# Altium schematic sheet Schemat_ideowy.SchDoc
size A4; SheetNumber: 1; SheetTotal: 1
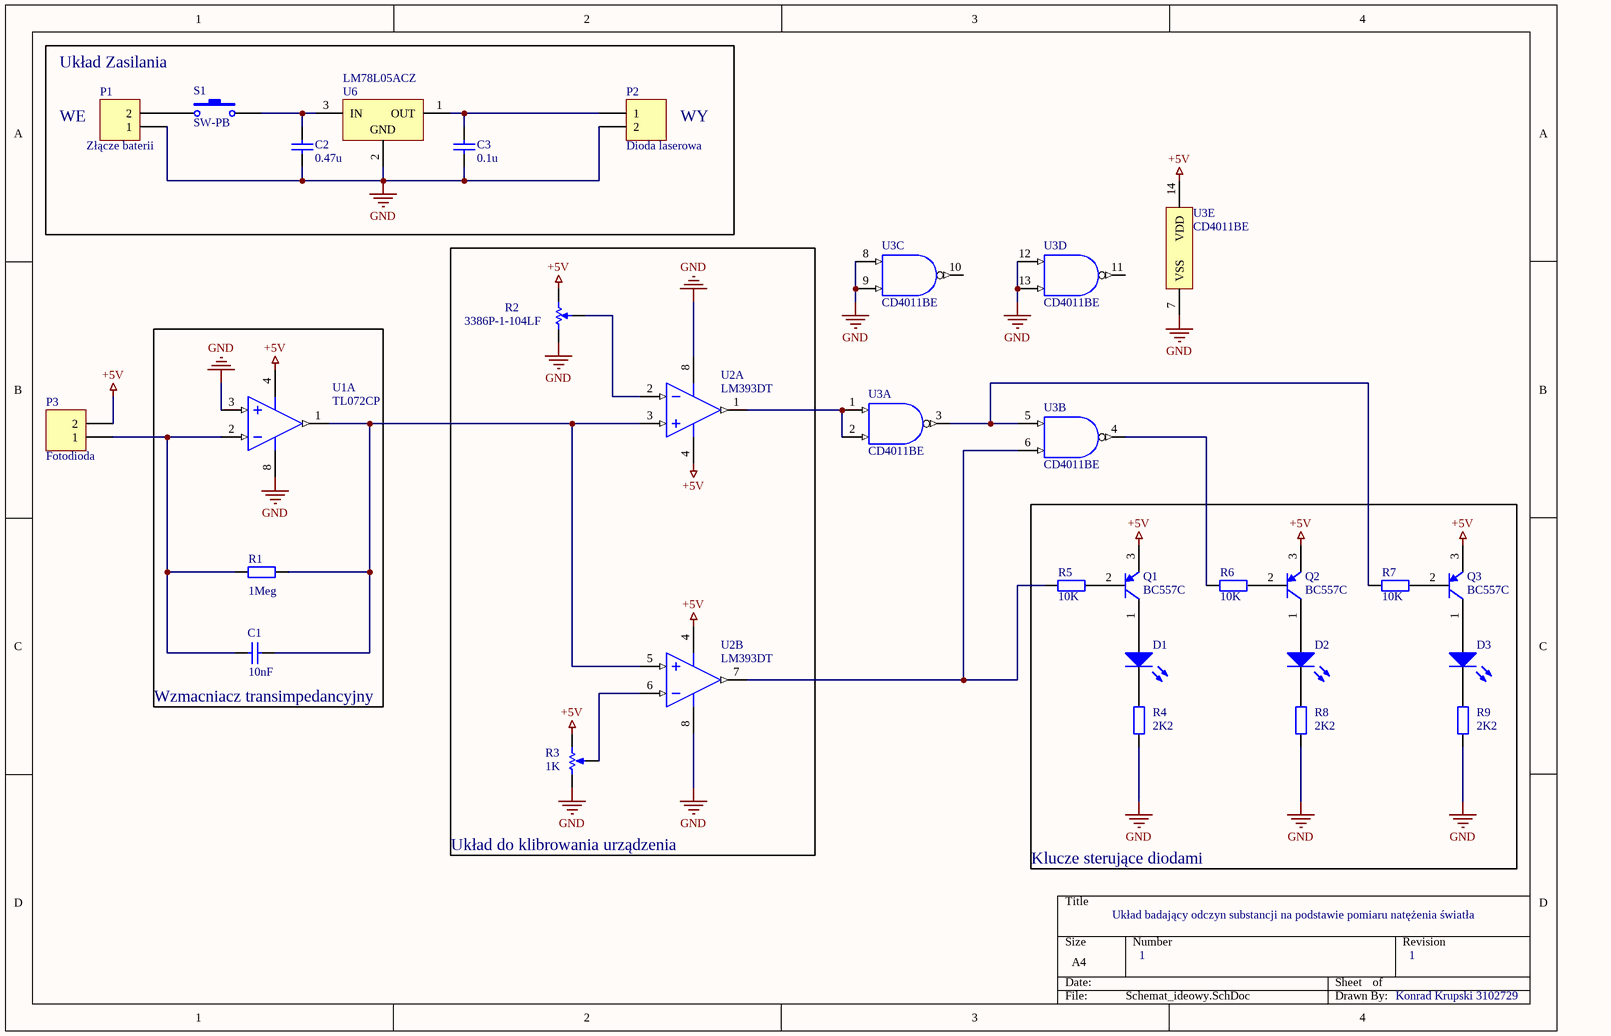
[diagram p0: Schemat_ideowy.SchDoc]

## Parts
C1  value 10nF  [RAD-0.3]  (hidden comment: Cap)
C2  value 0.47u  [RAD-0.3]  (hidden comment: Cap)
C3  value 0.1u  [RAD-0.3]  (hidden comment: Cap)
D1  LED3  [3.5X2.8X1.9]  (value not drawn)
D2  LED2  [3.2X1.6X1.1]  (value not drawn)
D3  LED2  [3.2X1.6X1.1]  (value not drawn)
P1  Złącze baterii  [HDR1X2H]
P2  Header 2H  [HDR1X2H]  (value not drawn)
P3  Fotodioda  [HDR1X2H]
Q1  BC557C  [ONSC-TO-92-3-29-11]
Q2  BC557C  [ONSC-TO-92-3-29-11]
Q3  BC557C  [ONSC-TO-92-3-29-11]
R1  value 1Meg  [AXIAL-0.4]  (hidden comment: Res2)
R2  3386P-1-104LF  [BOUR-3386P]
R3  value 1K  [VR5]  (hidden comment: RPot)
R4  value 2K2  [AXIAL-0.4]  (hidden comment: Res2)
R5  value 10K  [AXIAL-0.4]  (hidden comment: Res2)
R6  value 10K  [AXIAL-0.4]  (hidden comment: Res2)
R7  value 10K  [AXIAL-0.4]  (hidden comment: Res2)
R8  value 2K2  [AXIAL-0.4]  (hidden comment: Res2)
R9  value 2K2  [AXIAL-0.4]  (hidden comment: Res2)
S1  SW-PB  [SPST-2]
U1  TL072CP  [P0008A]  (part A of 2)
U2  LM393DT  [STM-SO-8_D_L]  (parts A,B of 2)
U3  CD4011BE  [N0014A]  (parts A,B,C,D,E of 5)
U6  LM78L05ACZ  [Z03A]

## Blocks framed on the sheet
Układ do klibrowania urządzenia: R2 R3 U2
Wzmacniacz transimpedancyjny: C1 R1 U1
Klucze sterujące diodami: D1-D3 Q1-Q3 R4-R9

## Nets
+5V: P3.2 Q1.3(E) Q2.3(E) Q3.3(E) R2.3 R3.2(BOT) U1.4(VCC-) U2.4(VCC-) U3.14(VDD)
GND: C2.1 C3.1 P1.1 P2.2 R2.1 R3.1(TOP) R4.1 R8.1 R9.1 U1.3(IN1+) U1.8(VCC+) U2.8(VCC+) U3.7(VSS) U3.8(E) U3.9(F) U3.12(G) U3.13(H) U6.2(GND)
NetC1_1: C1.1 P3.1 R1.1 U1.2(IN1-)
NetC1_2: C1.2 R1.2 U1.1(OUT1) U2.3(IN1+) U2.5(IN2+)
NetC2_2: C2.2 S1.2 U6.3(IN)
NetC3_2: C3.2 P2.1 U6.1(OUT)
NetD1_1: D1.1(A) Q1.1(C)
NetD1_2: D1.2(K) R4.2
NetD2_1: D2.1(A) Q2.1(C)
NetD2_2: D2.2(K) R8.2
NetD3_1: D3.1(A) Q3.1(C)
NetD3_2: D3.2(K) R9.2
NetP1_2: P1.2 S1.1
NetQ1_2: Q1.2(B) R5.1
NetQ2_2: Q2.2(B) R6.1
NetQ3_2: Q3.2(B) R7.1
NetR2_2: R2.2 U2.2(IN1-)
NetR3_3: R3.3(TAP) U2.6(IN2-)
NetR5_2: R5.2 U2.7(OUT2) U3.6(D)
NetR6_2: R6.2 U3.4(K)
NetR7_2: R7.2 U3.3(J) U3.5(C)
NetU2_1: U2.1(OUT1) U3.1(A) U3.2(B)

Not connected (* = marked no-connect by the designer): U3 10(L) 11(M)

## Notes on the sheet
- Układ Zasilania
- WE
- (near P2) Dioda laserowa
- WY
- Układ badający odczyn substancji na podstawie pomiaru natężenia światła
- 1
- Konrad Krupski 3102729

## Library data of the parts
C1-C3 = Cap: Capacitor; Published: 8-Jun-2000; LatestRevisionDate: 17-Jul-2002; LatestRevisionNote: Re-released for DXP Platform.; PackageReference: RAD-0.3; Publisher: Altium Limited; PackageDescription: Radial Cap, Thru-Hole; 2 Leads; 0.3 in Pin Spacing
D1 = LED3: Typical BLUE SiC LED; Published: 8-Jun-2000; LatestRevisionDate: 17-Dec-2003; LatestRevisionNote: PCB Footprint replaced.; DatasheetVersion: 16-Apr-2002; PackageVersion: 16-Apr-2002; PackageReference: 3.5X2.8X1.9; Publisher: Altium Limited; PackageDescription: SM LED; 2 C-Bend Leads; Body 3.5 x 2.8 x 1.9 mm, inc leads (LxWxH typ)
D2 D3 = LED2: Typical RED, GREEN, YELLOW, AMBER GaAs LED; Published: 8-Jun-2000; LatestRevisionDate: 17-Jul-2002; LatestRevisionNote: Re-released for DXP Platform.; PackageVersion: Feb-2002; PackageReference: 3.2X1.6X1.1; Publisher: Altium Limited; PackageDescription: SM LED; 2 Flat Leads
P1-P3 = Header 2H: Header, 2-Pin, Right Angle; LatestRevisionDate: 17-Jul-2002; LatestRevisionNote: Re-released for DXP Platform.; Publisher: Altium Limited
Q1-Q3 = CMP-1048-01449-1: Amplifier Transistor, PNP Silicon, 3-Pin TO-92, Bulk Box; Manufacturer: On Semiconductor; IC Continuous (A): -0.1; Polarity: PNP; PartNumber: BC557C; PackageVersion: Rev. AM; RoHS: FALSE; PackageDescription: 3-Pin Transistor Outline, Body 4.825 x 3.685 mm, Pitch 1.27 mm; Packing: Bulk Box; ComponentLink2Description: Datasheet; DatasheetVersion: Rev. 3; ComponentLink3Description: Package Specification; Mounting Technology: Through Hole; ComponentLink2URL: http://www.onsemi.com/pub_link/Collateral/BC556B-D.PDF; ComponentLink1URL: http://www.onsemi.com/; ComponentLink1Description: Manufacturer URL; ComponentLink3URL: http://www.onsemi.cn/pub_link/Collateral/2N6426-D.PDF; PackageReference: TO-92-3-29-11_AM_SL
R1 R4-R9 = Res2: Resistor; Published: 8-Jun-2000; LatestRevisionDate: 17-Jul-2002; LatestRevisionNote: Re-released for DXP Platform.; PackageReference: AXIAL-0.4; Publisher: Altium Limited; PackageDescription: Axial Device, Thru-Hole; 2 Leads; 0.4 in Pin Spacing
R2 = CMP-2000-05592-1: Square Trimpot(R) Trimming Potentiometer, 100 KOhm, +/- 10%, 0.5 W, -55 to 125 degC, 3-Pin THD, RoHS, Tube; Manufacturer Series: 3386; Manufacturer: Bourns; Resistive Element Material: Cermet; Shaft Diameter: 3.15mm; Number of Turns: 1; Product Height: 4.83mm; Temperature Coefficient: 100ppm/C; Product Depth: 9.53mm; Rated Temperature (Cel): 85; Actuator Orientation: Vertical; Resistance (ohm): 100000; Power Rating: 1/2W; Tolerance (%): 10; Rated Power Dissipation (P) (W): 0.5; Resistance Law: Linear; Actuator Type: Screw; Operating Temperature-Min (Cel): -55; Manufacturer URL: http://www.bourns.com/; Terminal Finish: TINLEAD; Datasheet Version: 05/2016; Tolerance: 10%; Lead Free: NO; Family: 3386; Product Length: 9.53mm; Mounting: ThroughHole; Packaging: Tube; Package: RectangularPackage; Mounting Feature: ThroughHole; Number of Terminals: 3; Minimum Operating Temperature: -55C; Mounting Technology: ThroughHole; Package Reference: 3386P; Maximum Operating Temperature: 125C; Termination Style: Pin; Datasheet URL: http://www.bourns.com/docs/Product-Datasheets/3386.pdf; Package Description: 3-Pin Through Hole Device, Body 9.53 x 9.53 mm, Pitch 2.54 mm; Product Type: Potentiometer; Operating Temperature-Max (Cel): 125; Resistance Value: 100KOhm; Terminal Shape: WIRE; Technology: Cermet; Type: Trimmer
R3 = RPot: Potentiometer; Sim Note: Enter the Resistance value and the set point into parameter fields.; Set Position: 0.5; Published: 8-Jun-2000; LatestRevisionDate: 17-Jul-2002; LatestRevisionNote: Re-released for DXP Platform.; PackageReference: VR5; Publisher: Altium Limited; PackageDescription: Variable Resistor, Thru-Hole; 3 Leads
S1 = SW-PB: Switch; Published: 24-Mar-1999; LatestRevisionDate: 17-Jul-2002; LatestRevisionNote: Re-released for DXP Platform.; PackageReference: SPST-2; Publisher: Altium Limited; PackageDescription: Switch; 2 Leads
U1 = CMP-0017-00950-2: Dual Low-Noise JFET-Input General-Purpose Operational Amplifier, 7 to 36 V, 0 to 70 degC, 8-pin DIP (P8), Pb-Free (RoHS); Manufacturer: Texas Instruments; Sub Family: General Purpose Amplifier, High Supply Voltage Amplifier (>=30V); Total Supply Voltage(Max)(+5V is 5, +/-5V is 10): 36; Slew Rate(Typ)(V/us): 13; Vn at 1kHz(Typ)(nV/rtHz): 18; GBW(Typ)(MHz): 3; CMRR(Min)(dB): 70; Total Supply Voltage(Min)(+5V is 5, +/-5V is 10): 7; Vio (25C)(Max)(mV): 10; Rating: Catalog; IIB(Max)(pA): 200; Iq per channel(Max)(mA): 2.5; Number of Channels: 2; Mounting Technology: Through Hole; ComponentLink3Description: Package Specification; PartNumber: TL072CP; PackageVersion: 4040082/E, 04/2010; Eco-Plan: Pb-Free (RoHS); DatasheetVersion: SLOS080J; Offset Drift(Typ)(uV/C): 18; ComponentLink3URL: http://www.ti.com/litv/pdf/mpdi001b; PackageDescription: 8-Pin Plastic In-Line, Body 9.59 x 6.35 mm, Pitch 2.54 mm; Code_JEDEC: MS-001; ComponentLink2URL: http://www.ti.com/lit/ds/symlink/tl072.pdf; ComponentLink1Description: Manufacturer URL; ComponentLink2Description: Datasheet; ComponentLink1URL: http://www.ti.com/; PackageReference: P0008A
U2 = CMP-2000-06550-1: Low-Power, Dual-Voltage Comparator, 2 to 36 V, 0 to 70 degC, 8-Pin SOIC (SO), RoHS, Tape and Reel; Manufacturer: STMicroelectronics; Voltage - Supply, Single/Dual (±): 2V~36V,±1V~18V; Current - Input Bias (Max): 0.25µA@5V; Number of Elements: 2; Current - Output (Typ): 18mA@5V; Other Names: 497-1593-2; Voltage - Input Offset (Max): 5mV@30V; Output Type: CMOS,DTL,ECL,MOS,Open-Collector,TTL; EDA / CAD Models: DownloadfromAcceleratedDesigns; Other Related Documents: LM393ViewAllSpecificationsLM393ViewAllSpecifications; Online Catalog: Comparators-2elements; Current - Quiescent (Max): 2.5mA; Standard Package: 2,500; Manufacturer URL: http://www.st.com/; Package Description: 8-Pin Small Outline Integrated Circuit, Body 4.9 x 3.9 mm, Pitch 1.27 mm; Packaging: Tape&Reel(TR); Datasheet Version: Rev. 15, 02/2016; Category: IntegratedCircuits(ICs); Operating Temperature: 0°C~70°C; Mounting Type: SurfaceMount; Supplier Device Package: 8-SO; Datasheet URL: http://www.st.com/content/ccc/resource/technical/document/datasheet/group1/b4/cc/cf/13/18/28/44/f5/CD00000465/files/CD00000465.pdf/jcr:content/translations/en.CD00000465.pdf; Family: Linear-Comparators; Mounting Technology: SurfaceMount; Type: GeneralPurpose; Package Reference: SO-8; Package / Case: 8-SOIC(0.154",3.90mmWidth)
U3 = CMP-1627-00488-2: CMOS Quad 2-Input NAND Gate, N0014A, TUBE; Manufacturer: Texas Instruments; Schmitt Trigger: No; Bits(#): 4; Voltage(Nom)(V): 10; Output Drive (IOL/IOH)(Max)(mA): 1.5/-1.5; ICC @ Nom Voltage(Max)(mA): 0.015; Technology Family: CD4000; VCC(Max)(V): 18; Rating: Military; VCC(Min)(V): 3; F @ Nom Voltage(Max)(Mhz): 8; Output Type: CMOS; Input Type: CMOS; PackageReference: N0014A; Code_JEDEC: MS-001; Operating Temperature Range(C): -55 to 125; Generic Part Number: CD4011B; DatasheetVersion: SCHS021D
U6 = CMP-0062-00042-2: 3-Terminal Positive Regulators, 3-pin TO-92; Manufacturer: National Semiconductor; PackageTopMarking: NSXYTT*LM78L*05ACZ; PowerWise: N; CompType: LDO IC; PackageVersion: revG, Sep-2000; ComponentLink3Description: Z03A Package Page; ComponentLink2Description: LM78L05 Web Page; PackageDescription: TO-92, Molded, 3 Lead; RoHS: N; RevisionNote: Component URLs added; PackageReference: Z03A; ComponentLink1URL: http://www.national.com/ds/LM/LM78L05.pdf; Code_JEDEC: TO-226-AA; ComponentLink1Description: LM78L05 Datasheet; PinCount: 3; ComponentLink2URL: http://www.national.com/pf/LM/LM78L05.html; ComponentLink3URL: http://www.national.com/packaging/folders/z03a.html; DatasheetVersion: Apr-2006